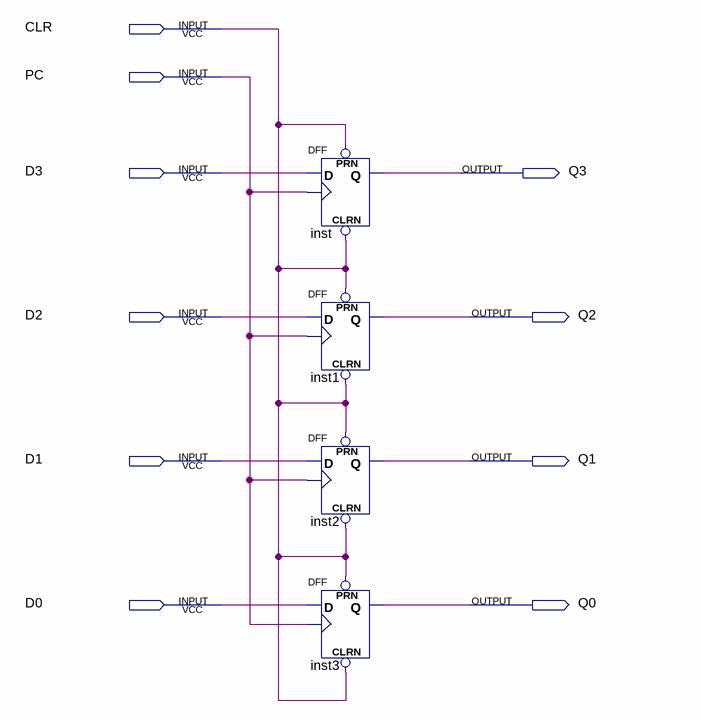
[diagram p0: schematic sheet]
// Quartus schematic register-4_with_CLR.bdf as structural Verilog: 4 symbols, 10 pins
module \register-4_with_CLR  (
  input  CLR,
  input  PC,
  input  D3,
  input  D2,
  input  D1,
  input  D0,
  output Q3,
  output Q2,
  output Q1,
  output Q0
);

  DFF inst (.CLRN(CLR), .CLK(PC), .D(D3), .PRN(CLR), .Q(Q3));
  DFF inst1 (.CLRN(CLR), .CLK(PC), .D(D2), .PRN(CLR), .Q(Q2));
  DFF inst2 (.CLRN(CLR), .CLK(PC), .D(D1), .PRN(CLR), .Q(Q1));
  DFF inst3 (.CLRN(CLR), .CLK(PC), .D(D0), .PRN(CLR), .Q(Q0));
endmodule
